# EAGLE design in_voltage_ctl (EAGLE 7.2.0)
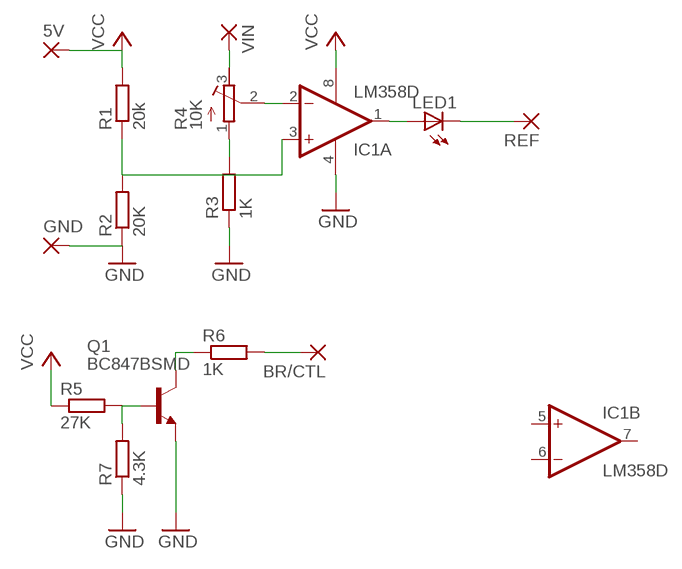
[diagram p0: schematic, sheet 1]

## Parts
5V  SMD2  [SMD1,27-2,54]
BR/CTL  SMD2  [SMD1,27-2,54]
GND  SMD2  [SMD1,27-2,54]
IC1  LM358D  [SO08]
LED1  LEDSML0805  [SML0805]
Q1  BC847BSMD  [SOT23]
R1  20k  R-EU_R0805  [R0805]
R2  20K  R-EU_R0805  [R0805]
R3  1K  R-EU_R0805  [R0805]
R4  10K  R-TRIMM3296W  [RTRIM3296W]
R5  27K  R-EU_R0805  [R0805]
R6  1K  R-EU_R0805  [R0805]
R7  4.3K  R-EU_R0805  [R0805]
REF  SMD2  [SMD1,27-2,54]
VIN  SMD2  [SMD1,27-2,54]

## Nets
GND: GND.1(P) IC1.4(P:V-) Q1.2(E) R2.1 R3.1 R7.1
N$1: IC1.3(A:+IN) R1.1 R2.2
N$5: IC1.1(A:OUT) LED1.A
N$6: LED1.C REF.1(P)
N$7: Q1.1(B) R5.2 R7.2
N$8: Q1.3(C) R6.1
N$9: BR/CTL.1(P) R6.2
REF: IC1.2(A:-IN) R4.2(S)
REF_GND: R3.2 R4.1(A)
VCC: 5V.1(P) IC1.8(P:V+) R1.2 R5.1
VIN: R4.3(E) VIN.1(P)
Unconnected: IC1.5(B:+IN) IC1.6(B:-IN) IC1.7(B:OUT)

## Library data of the parts
5V BR/CTL GND REF VIN = wirepad:SMD2: SMD PAD
IC1 = linear:LM358: OP AMP also LM158; LM258; LM2904 Source: http://cache.national.com/ds/LM/LM158.pdf
LED1 = led:LED: LED OSRAM: - CHIPLED LG R971, LG N971, LY N971, LG Q971, LY Q971, LO R971, LY R971 LH N974, LH R974 LS Q976, LO Q976, LY Q976 LO Q996 - Hyper CHIPLED LW Q18S LB Q993, LB Q99A, LB R99A - SideLED LS A670, LO A670, LY A670, LG A670, LP A670 LB A673, LV A673, LT A673, LW A673 LH A674 LY A675 LS A676, LA A676, LO A676, LY A676, LW A676 LS A679, LY A679, LG A679 - Hyper Micro SIDELED® LS Y876, LA Y876, LO Y876, LY Y876 LT Y87S - SmartLED LW L88C, LW L88S LB L89C, LB L89S, LG L890 LS L89K, LO L89K, LY L89K LS L896, LA L896, LO L896, LY L896 - TOPLED LS T670, LO T670, LY T670, LG T670, LP T670 LSG T670, LSP T670, LSY T670, LOP T670, LYG T670 LG T671, LOG T671, LSG T671 LB T673, LV T673, LT T673, LW T673 LH T674 LS T676, LA T676, LO T676, LY T676, LB T676, LH T676, LSB T676, LW T676 LB T67C, LV T67C, LT T67C, LS T67K, LO T67K, LY T67K, LW E67C LS E67B, LA E67B, LO E67B, LY E67B, LB E67C, LV E67C, LT E67C LW T67C LS T679, LY T679, LG T679 LS T770, LO T770, LY T770, LG T770, LP T770 LB T773, LV T773, LT T773, LW T773 LH T774 LS E675, LA E675, LY E675, LS T675 LS T776, LA T776, LO T776, LY T776, LB T776 LHGB T686 LT T68C, LB T68C - Hyper Mini TOPLED® LB M676 - Mini TOPLED Santana® LG M470 LS M47K, LO M47K, LY M47K Source: http://www.osram.convergy.de LUXEON: - LUMILED® LXK2-PW12-R00, LXK2-PW12-S00, LXK2-PW14-U00, LXK2-PW14-V00 LXK2-PM12-R00, LXK2-PM12-S00, LXK2-PM14-U00 LXK2-PE12-Q00, LXK2-PE12-R00, LXK2-PE12-S00, LXK2-PE14-T00, LXK2-PE14-U00 LXK2-PB12-K00, LXK2-PB12-L00, LXK2-PB12-M00, LXK2-PB14-N00, LXK2-PB14-P00, LXK2-PB14-Q00 LXK2-PR12-L00, LXK2-PR12-M00, LXK2-PR14-Q00, LXK2-PR14-R00 LXK2-PD12-Q00, LXK2-PD12-R00, LXK2-PD12-S00 LXK2-PH12-R00, LXK2-PH12-S00 LXK2-PL12-P00, LXK2-PL12-Q00, LXK2-PL12-R00 Source: www.luxeon.com KINGBRIGHT: KA-3528ASYC Source: www.kingbright.com
Q1 = transistor-npn:BC847*: NPN Transistor
R1-R3 R5-R7 = rcl:R-EU_: RESISTOR, European symbol
R4 = rcl:R-TRIMM: Trimm resistor

## Board
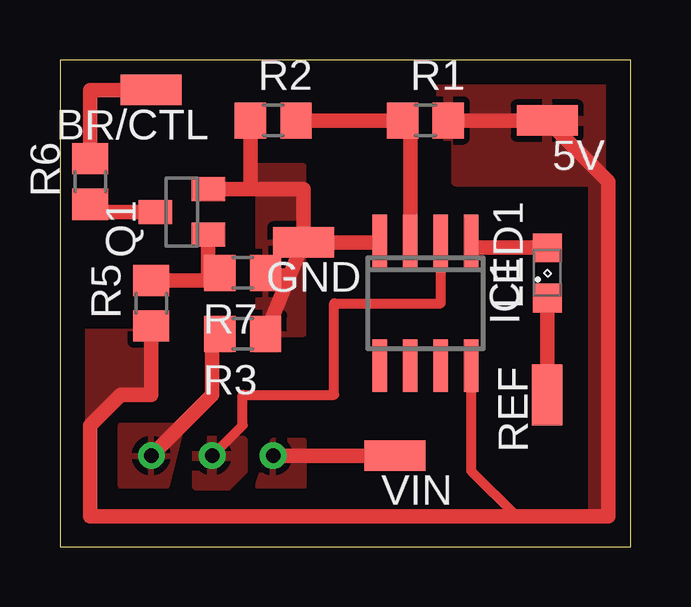
[diagram p1: board, top side]
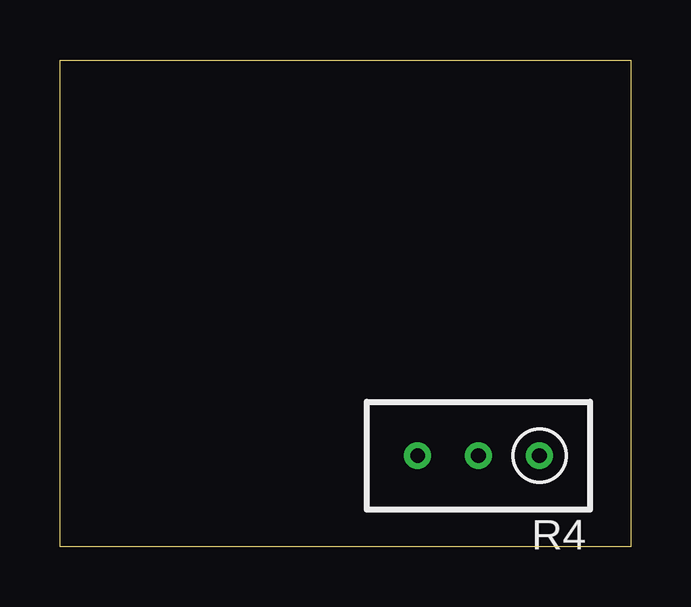
[diagram p2: board, bottom side, seen from below]

Size 23.8 x 20.31 mm. Coordinates in mm from the lower left corner, seen from the top.
Outline: 0,0 23.8,0 23.8,20.31 0,20.31 0,0
Copper layers (1*16): Top 0.035mm / dielectric 1.5mm / Bottom 0.035mm
Design rules "default": minimum track width 10mil, minimum drill 24mil, track to track 8mil, track to pad 8mil, pad to pad 8mil, via to via 8mil, smd to smd 8mil, copper to edge 40mil, drill to drill 8mil, minimum pad ring 10mil, minimum via ring 8mil, stop-mask expansion 4mil, vias tented up to drill 0mil, thermal gap 10mil

### Footprints (pad centres in the part's own frame; a part is rotated, then mirrored left to right if it is on the bottom)
SMD1,27-2,54 = smd 1.27 x 2.54: 1 0,0
SO08 = smd 0.6 x 2.2: 1 -1.905,-2.6; 2 -0.635,-2.6; 3 0.635,-2.6; 4 1.905,-2.6; 5 1.905,2.6; 6 0.635,2.6; 7 -0.635,2.6; 8 -1.905,2.6
SML0805 = smd 1.2 x 1.2: A 1.05,0; C -1.05,0
SOT23 = smd 1 x 1.4: 1 -0.95,-1.1; 2 0.95,-1.1; 3 0,1.1
R0805 = smd 1.3 x 1.5: 1 -0.95,0; 2 0.95,0
RTRIM3296W = drill 0.61: 1 0,-2.54; 2 0,0; 3 0,2.54

### Placement (x,y rotation side)
5V  20.32,17.78 90 top
BR/CTL  3.81,19.05 90 top
GND  10.16,12.7 90 top
IC1  15.24,10.16 180 top
LED1  20.32,11.43 90 top
Q1  5.08,13.97 90 top
R1  15.24,17.78 0 top
R2  8.89,17.78 0 top
R3  7.62,8.89 180 top
R4  6.35,3.81 90 bottom
R5  3.81,10.16 90 top
R6  1.27,15.24 90 top
R7  7.62,11.43 180 top
REF  20.32,6.35 0 top
VIN  13.97,3.81 90 top

### Tracks (layer width: path | path; a pad name or v marks a point on that pad's centre or on a via)
GND
  Top 0.406: R7.1 9.52,11.43 9.52,11.17
  Top 0.61: R3.1 9.52,11.17 GND.1 | IC1.4 13.34,12.7 GND.1 | GND.1 10.16,14.92 7.94,14.92 | 7.94,14.92 Q1.2 | R2.1 7.94,14.92
  pour Top: 8.26,15.88 8.26,8.89 10.16,8.89 10.16,15.88
N$1
  Top 0.61: R2.2 R1.1 14.61,17.78 IC1.3
N$5
  Top 0.61: IC1.1 17.14,12.48 LED1.A
N$6
  Top 0.61: LED1.C REF.1
N$7
  Top 0.406: R7.2 6.18,11.43
  Top 0.61: R5.2 6.18,11.11 6.18,11.43 Q1.1
N$8
  Top 0.61: Q1.3 1.59,13.97 arc-90 R6.1
N$9
  Top 0.61: BR/CTL.1 1.27,19.05 R6.2
REF
  Top 0.406: R4.2 7.62,5.08 7.62,6.35 11.43,6.35 11.43,10.16 15.88,10.16 IC1.2
  pour Top: 5.71,4.45 7.62,4.45 7.62,3.17 6.99,2.54 5.71,2.54
REF_GND
  Top 0.61: R4.1 6.35,6.35 6.35,8.57 R3.2
  pour Top: 2.54,5.08 5.08,5.08 4.45,2.54 2.54,2.54
VCC
  Top 0.406: IC1.8 17.14,3.17 19.05,1.27
  Top 0.61: R5.1 3.81,6.35 2.54,6.35 1.27,5.08 1.27,1.27 19.05,1.27 22.86,1.27 22.86,15.24 5V.1 R1.2
  pour Top: 3.81,8.89 0.64,8.89 0.64,0.64 23.5,0.64 23.5,19.68 15.88,19.68 15.88,17.14 16.51,17.14 16.51,15.24 22.23,15.24 22.23,1.27 1.27,1.27 1.27,5.08 2.54,6.35 3.81,6.35
VIN
  Top 0.61: R4.3 VIN.1
  pour Top: 8.89,4.45 10.16,4.45 10.16,2.54 8.26,2.54